# Altium schematic sheet USB_Interface.SchDoc
size A4
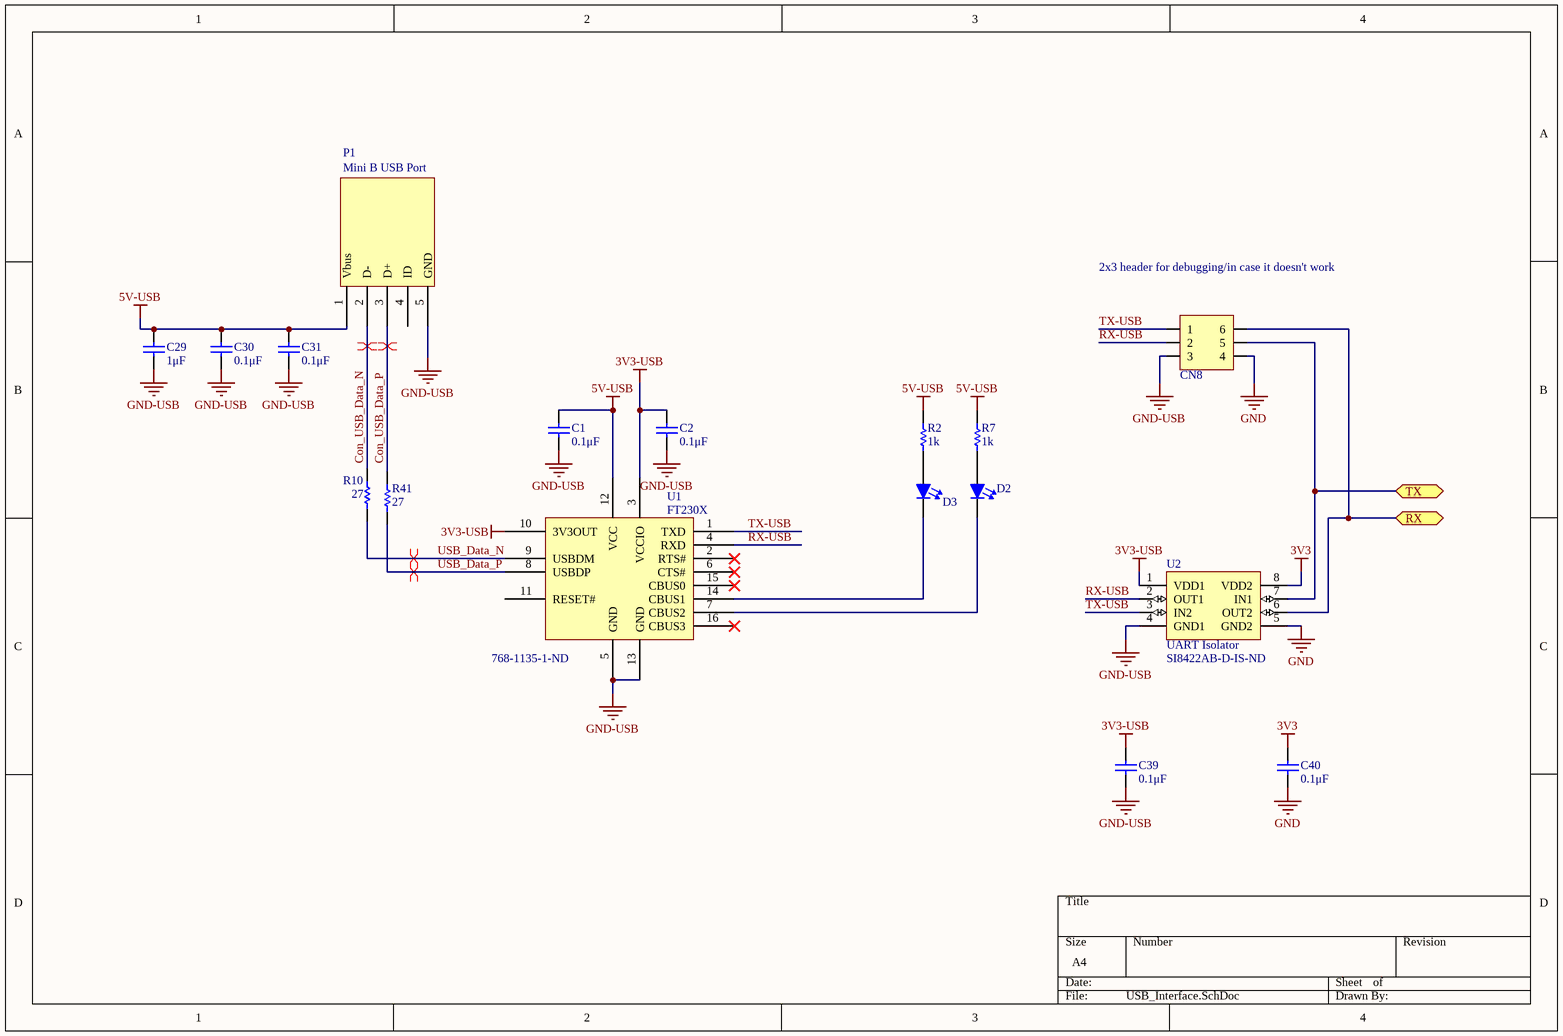
[diagram p0: USB_Interface.SchDoc]

## Parts
C1  0.1μF  [CAPC1608N(0603")]
C2  0.1μF  [CAPC1608N(0603")]
C29  1μF  [CAPC1608N(0603")]
C30  0.1μF  [CAPC1608N(0603")]
C31  0.1μF  [CAPC1608N(0603")]
C39  0.1μF  [CAPC1608N(0603")]
C40  0.1μF  [CAPC1608N(0603")]
CN8  Header, Male, 2x3, Pitch: 0.1" (2.54mm), THT  [Header, Male, 2x3, Pitch: 0.1" (2.54mm),THT]  (value not drawn)
D2  Red  [LED0805]  (value not drawn)
D3  Red  [LED0805]  (value not drawn)
P1  Mini B USB Port  [Mini B USB Footprint]
R2  1k  [RESC1608N(0603")]
R7  1k  [RESC1608N(0603")]
R10  27  [RESC1608N(0603")]
R41  27  [RESC1608N(0603")]
U1  FT230X  Supplier Part Number 1: 768-1135-1-ND  [SSOP16]
U2  UART Isolator  Supplier Part Number 1: SI8422AB-D-IS-ND  [SOIC-SN8_M]

## Ports
RX, TX

## Nets
3V3: C40.2(Cathode) U2.8(VDD2)
3V3-USB: C2.2(Cathode) C39.2(Cathode) U1.3(VCCIO) U1.10(3V3OUT) U2.1(VDD1)
5V-USB: C1.2(Cathode) C29.2(Cathode) C30.2(Cathode) C31.2(Cathode) P1.1(Vbus) R2.2 R7.2 U1.12(VCC)
GND: C40.1(Anode) CN8.4 U2.5(GND2)
GND-USB: C1.1(Anode) C2.1(Anode) C29.1(Anode) C30.1(Anode) C31.1(Anode) C39.1(Anode) CN8.3 P1.5(GND) U1.5(GND) U1.13(GND) U2.4(GND1)
Con_USB_Data_N: P1.2(D-) R10.1
Con_USB_Data_P: P1.3(D+) R41.1
RX: CN8.6 U2.6(OUT2) ; port RX
RX-USB: CN8.2 U1.4(RXD) U2.2(OUT1)
TX: CN8.5 U2.7(IN1) ; port TX
TX-USB: CN8.1 U1.1(TXD) U2.3(IN2)
USB_Data_N: R10.2 U1.9(USBDM)
USB_Data_P: R41.2 U1.8(USBDP)
NetD2_1: D2.1(Cathode) U1.7(CBUS2)
NetD2_2: D2.2(Anode) R7.1
NetD3_1: D3.1(Cathode) U1.14(CBUS1)
NetD3_2: D3.2(Anode) R2.1

Not connected (* = marked no-connect by the designer): P1 4(ID); U1 2(RTS#)* 6(CTS#)* 11(RESET#) 15(CBUS0)* 16(CBUS3)*

## Layout directives
differential pair: Con_USB_Data_N, Con_USB_Data_P, USB_Data_N, USB_Data_P

## Notes on the sheet
- 2x3 header for debugging/in case it doesn't work

## Library data of the parts
C1 C2 C30 C31 C39 C40 = 0.1uF 100V 0603 SMD, Ceramic: Capacitor, Ceramic, 100V, +/- 10%, 0603 SMD, X7R; MFG: TDK; MFG#: CGA3E3X7S2A104K080AB; Published: 16-04-26; Publisher: AUVic; PackageDescription: Chip Capacitor; Value: 0.1μF; Created By: Ashwin Sira; Supplier 1: Digi-Key; Supplier Part Number 1: 445-6938-1-ND
C29 = 1uF 25V 0603 SMD, Ceramic: Capacitor, Ceramic, 25V, +/- 10%, 0603 SMD, X5R; MFG: Murata-Electronics-North-America; MFG#: GRM188R61E105KA12D; Published: 16-06-27; Publisher: AUVic; PackageDescription: Chip Capacitor; Value: 1μF; Created By: Andy Bates; Supplier 1: Digi-Key; Supplier Part Number 1: 490-3897-1-ND
D2 = LED, 0805 (2012), Green, Clear: Colour: Red; Created By: Andy Bates; Supplier 1: Digi-Key; Supplier Part Number 1: 475-1410-1-ND
D3 = LED, 0805 (2012), Red, Clear: Supplier 1: Digi-Key; Supplier Part Number 1: 732-4984-1-ND; Colour: Red; Created By: Ashwin Sira
P1 = Mini B USB Port: Mini B USB Port - Female; Created by: Gabriel Green; Created on: July 5, 2017; Supplier 1: Digi-Key; Supplier Part Number 1: 151-1206-1-ND
R2 R7 = 1kR, 1%, 1/10W , 0603, SMD: Created By: Andy Bates; Publisher: AUVic; Date Created: 2017-05-10; Value: 1k; Supplier 1: Digikey; Supplier Part Number 1: 311-1.00KHRCT-ND
R10 R41 = 27 Ohm, 1%, 1/10W , 0603, SMD: Created By: Andy Bates; Publisher: AUVic; Date Created: 2017-10-13; Value: 27; Supplier 1: Digi-Key; Supplier Part Number 1: 311-27.0HRCT-ND
U1 = FTDI - USB to UART: Supplier 1: Digi-Key; Created by: Gabriel Green; Created on: July 5th, 2017
U2 = UART Isolators 1Mbps 2.7-5.5V: UART Isolators 1/1 1Mbps; Made By: Andy Bates; Created On: 2017/09/10; Supplier 1: Digi-Key
CN8 = Header, Male, 2x3, Pitch: 0.1" (2.54mm), THT: Publisher: AUVic; Date Published: 2017-09-13; Last Updated: *; Reviewed By: *; Created By: Andy Bates